# EAGLE design bandpass 40m v2 (EAGLE 9.1.2)
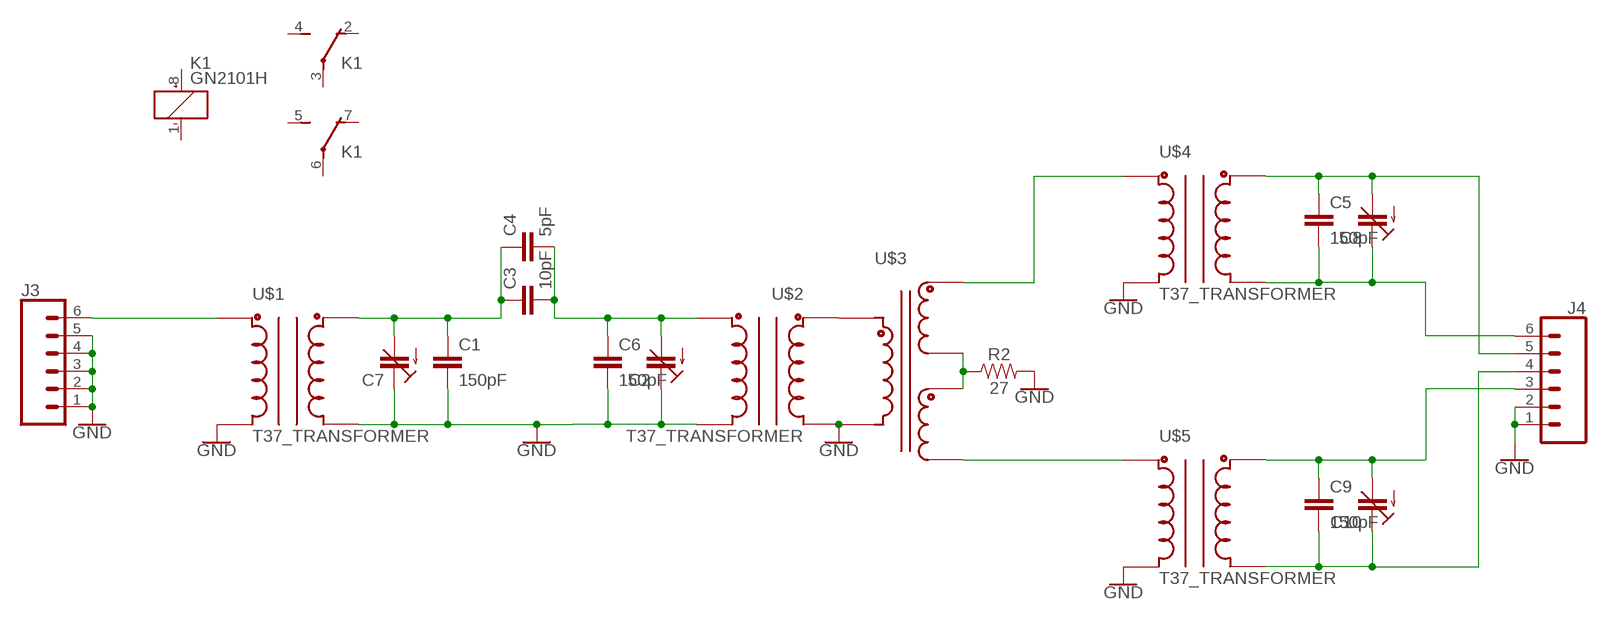
[diagram p0: schematic, sheet 1]

## Parts
C1  150pF  C5/3.5  [C5B3.5]
C2  C-TRIMMTZ03  [CTRIMTZ03]
C3  10pF  C5/3.5  [C5B3.5]
C4  5pF  C5/3.5  [C5B3.5]
C5  150pF  C5/3.5  [C5B3.5]
C6  150pF  C5/3.5  [C5B3.5]
C7  C-TRIMMTZ03  [CTRIMTZ03]
C8  C-TRIMMTZ03  [CTRIMTZ03]
C9  150pF  C5/3.5  [C5B3.5]
C10  C-TRIMMTZ03  [CTRIMTZ03]
J3  CONN_06SILK_FEMALE_PTH  [1X06]
J4  CONN_06SILK_FEMALE_PTH  [1X06]
K1  GN2101H  [GN]
R2  27  1KOHM-HORIZ-1/4W-1%  [AXIAL-0.3]
U$1  T37_TRANSFORMER  [T37_TRANSFORMER]
U$2  T37_TRANSFORMER  [T37_TRANSFORMER]
U$3  T50_SPLITTER  [T50_SPLITTER]
U$4  T37_TRANSFORMER  [T37_TRANSFORMER]
U$5  T37_TRANSFORMER  [T37_TRANSFORMER]

## Nets
GND: C1.2 C2.1(E) C6.2 C7.1(E) J3.1 J3.2 J3.3 J3.4 J3.5 J4.1 J4.2 R2.P$2 U$1.C1A U$1.C2A U$2.C1A U$2.C2A U$3.C1A U$4.C1A U$5.C1A
GND1: C5.2 C8.1(E) J4.6 U$4.C2A
GND2: C9.2 C10.1(E) J4.4 U$5.C2A
N$1: C1.1 C3.1 C4.1 C7.2(A) U$1.C2B
N$2: J3.6 U$1.C1B
N$3: C2.2(A) C3.2 C4.2 C6.1 U$2.C2B
N$4: U$2.C1B U$3.C1B
N$5: U$3.C3B(C2B) U$4.C1B
N$6: R2.P$1 U$3.C2A(C3B) U$3.C3A(C2A)
N$7: U$3.C2B(C3A) U$5.C1B
N$8: C5.1 C8.2(A) J4.5 U$4.C2B
N$9: C9.1 C10.2(A) J4.3 U$5.C2B
Unconnected: K1.1(R:-) K1.2(S:O) K1.3(S:P) K1.4(S:S) K1.5(T:S) K1.6(T:P) K1.7(T:O) K1.8(R:+)

## Library data of the parts
C1 C3-C6 C9 = capacitor-wima:C: CAPACITOR naming: grid - package width
C2 C7 C8 C10 = resistor:C-TRIMM: Trimm capacitor
J3 J4 = SparkFun-Connectors:CONN_06: Multi connection point. Often used as Generic Header-pin footprint for 0.1 inch spaced/style header connections On any of the 0.1 inch spaced packages, you can populate with these: Break Away Headers - Straight <https://www.sparkfun.com/products/116> (PRT-00116) Break Away Male Headers - Right Angle <https://www.sparkfun.com/products/553> (PRT-00553) Female Headers <https://www.sparkfun.com/products/115> (PRT-00115) Break Away Headers - Machine Pin <https://www.sparkfun.com/products/117> (PRT-00117) Break Away Female Headers - Swiss Machine Pin <https://www.sparkfun.com/products/743> (PRT-00743) Arduino Stackable Header - 6 Pin <https://www.sparkfun.com/products/9280> (PRT-09280) For SCREWTERMINALS and SPRING TERMINALS visit here: Screw Terimnals on SparkFun.com <https://www.sparkfun.com/search/results?term=Screw+Terminals> (5mm/3.5mm/2.54mm spacing) This device is also useful as a general connection point to wire up your design to another part of your project. Our various solder wires solder well into these plated through hole pads. Hook-Up Wire - Assortment (Stranded, 22 AWG) <https://www.sparkfun.com/products/11375> (PRT-11375) Hook-Up Wire - Assortment (Solid Core, 22 AWG) <https://www.sparkfun.com/products/11367> (PRT-11367) View the entire wire category on our website here <https://www.sparkfun.com/categories/141>; PROD_ID: CONN-08437
K1 = relay:GN?*: ULTRA-SMALL PACKAGE SLIM POLARIZED RELAY NAiS Source: http://www.mew-europe.com/.. en_ds_61007_0000.pdf; OC_FARNELL: unknown; OC_NEWARK: unknown
R2 = SparkFun-Resistors:1KOHM: 1kΩ resistor A resistor is a passive two-terminal electrical component that implements electrical resistance as a circuit element. Resistors act to reduce current flow, and, at the same time, act to lower voltage levels within circuits. - Wikipedia; PROD_ID: RES-12182; VALUE: 1k
U$1 U$2 U$4 U$5 = toroid:T37_TRANSFORMER: Transformer wound on a T37 Toroid
U$3 = toroid:T50_SPLITTER: Transformer (having 3 windings) on a T50 Toroid

## Net classes
0 default: width 0.762 mm, drill 0.762 mm, clearance 0.508 mm

## Board
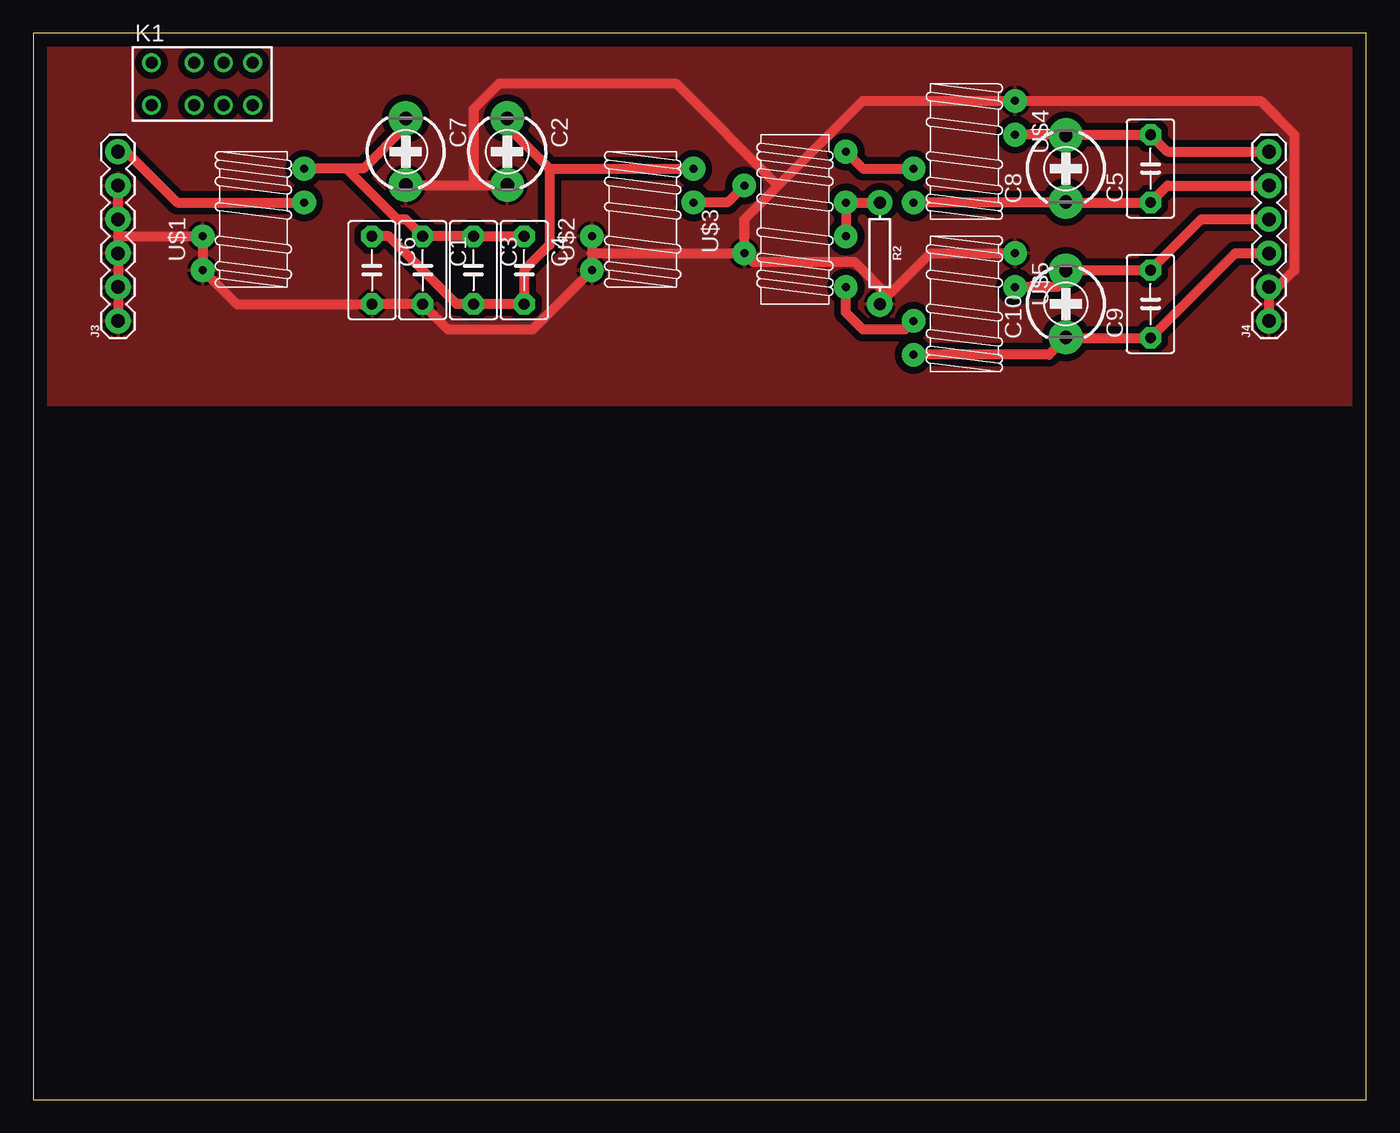
[diagram p1: board, top side]

Size 100 x 80 mm. Coordinates in mm from the lower left corner, seen from the top.
Outline: 0,0 100,0 100,80 0,80 0,0
Copper layers (1*16): Top 0.035mm / dielectric 1.5mm / Bottom 0.035mm
Design rules "default": minimum track width 6mil, minimum drill 0.35mm, track to track 6mil, track to pad 6mil, pad to pad 6mil, via to via 6mil, smd to smd 6mil, copper to edge 40mil, drill to drill 6mil, minimum pad ring 10mil, minimum via ring 8mil, stop-mask expansion 4mil, vias tented up to drill 0mil, thermal gap 10mil

### Footprints (pad centres in the part's own frame; a part is rotated, then mirrored left to right if it is on the bottom)
C5B3.5 = drill 0.813 pad 1.6 octagon: 1 -2.54,0; 2 2.54,0
CTRIMTZ03 = drill 1 pad 2.54: 1 0,2.5; 2 0,-2.5
1X06 = drill 1.016 pad 1.88: 1 0,0; 2 2.54,0; 3 5.08,0; 4 7.62,0; 5 10.16,0; 6 12.7,0
GN = drill 0.9: 1 -3.835,-1.6; 2 -0.635,-1.6; 3 1.565,-1.6; 4 3.765,-1.6; 5 3.765,1.6; 6 1.565,1.6; 7 -0.635,1.6; 8 -3.835,1.6
AXIAL-0.3 = drill 0.9 pad 1.88: P$1 -3.81,0; P$2 3.81,0
T37_TRANSFORMER = drill 0.6 pad 1.778: C1A -3.81,-3.81; C1B 3.81,1.27; C2A -3.81,-1.27; C2B 3.81,3.81
T50_SPLITTER = drill 0.6 pad 1.778: C1A -1.27,-5.08; C1B -1.27,0; C2A 6.35,-3.81; C2B 6.35,-7.62; C3A 6.35,-1.27; C3B 6.35,2.54

### Placement (x,y rotation side)
C1  29.21,62.23 270 top
C2  35.56,71.12 180 top
C3  33.02,62.23 270 top
C4  36.83,62.23 270 top
C5  83.82,69.85 90 top
C6  25.4,62.23 270 top
C7  27.94,71.12 180 top
C8  77.47,69.85 0 top
C9  83.82,59.69 90 top
C10  77.47,59.69 0 top
J3  6.35,58.42 90 top
J4  92.71,58.42 90 top
K1  12.7,76.2 0 top
R2  63.5,63.5 270 top
U$1  16.51,66.04 0 top
U$2  45.72,66.04 0 top
U$3  54.61,68.58 0 top
U$4  69.85,71.12 180 top
U$5  69.85,59.69 180 top

### Tracks (layer width: path | path; a pad name or v marks a point on that pad's centre or on a via)
GND
  Top 0.762: J3.1 J3.2 J3.3 6.35,64.77 | 6.35,64.77 J3.4 J3.5 | 6.35,64.77 U$1.C2A U$1.C1A 15.24,59.69 C6.2 C1.2 31.11,57.78 37.47,57.78 U$2.C1A 41.91,63.5 | U$5.C1A 67.31,63.5 64.14,60.33 | 33.02,68.58 35.56,68.58 C2.1 | 33.02,68.58 27.94,68.58 C7.1 | J4.1 J4.2 93.34,60.96 94.61,62.23 94.61,72.39 92.08,74.93 U$4.C1A 62.23,74.93 55.88,68.58 | U$2.C2A 41.91,63.5 | 41.91,63.5 U$3.C1A | 55.88,68.58 53.34,66.04 U$3.C1A | 33.02,68.58 33.02,74.3 34.92,76.2 48.26,76.2 55.88,68.58 | 64.14,60.33 61.59,62.87 53.98,62.87 U$3.C1A | 64.14,60.33 R2.P$2
  pour Top: 0,80.01 100.33,80.01 100.33,52.07 0,52.07
GND1
  Top 0.762: 77.47,72.39 C5.2 85.09,71.12 J4.6 | 77.47,72.39 U$4.C2A | 77.47,72.39 C8.1
GND2
  Top 0.762: U$5.C2A 76.83,60.96 77.47,61.59 C10.1 77.47,62.23 C9.2 87.63,66.04 J4.4
N$1
  Top 0.762: C4.1 C3.1 C1.1 27.94,66.04 27.3,66.04 23.5,69.85 | 23.5,69.85 24.77,69.85 27.94,73.03 C7.2 | 23.5,69.85 U$1.C2B
N$2
  Top 0.762: U$1.C1B 10.79,67.31 6.99,71.12 J3.6
N$3
  Top 0.762: C6.1 26.67,64.77 31.75,59.69 C3.2 C4.2 36.83,62.23 38.73,64.14 38.73,69.85 | 38.73,69.85 U$2.C2B | 38.73,69.85 35.56,73.03 C2.2
N$4
  Top 0.762: U$2.C1B 52.07,67.31 U$3.C1B
N$5
  Top 0.762: U$4.C1B 62.23,69.85 U$3.C3B
N$6
  Top 0.762: U$3.C2A U$3.C3A R2.P$1
N$7
  Top 0.762: U$3.C2B 60.96,59.05 62.23,57.78 65.41,57.78 U$5.C1B
N$8
  Top 0.762: 77.47,67.31 C5.1 85.09,68.58 J4.5 | 77.47,67.31 U$4.C2B | 77.47,67.31 C8.2
N$9
  Top 0.762: 77.47,57.15 C9.1 90.17,63.5 J4.3 | U$5.C2B 76.2,55.88 77.47,57.15 | 77.47,57.15 C10.2